# Altium schematic sheet PWR-1-cell Li-ion charger.SchDoc
size Letter
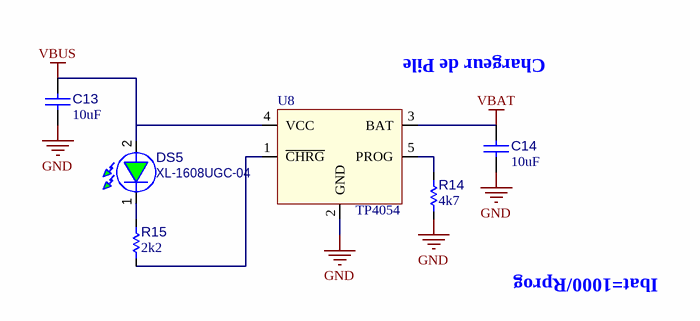
[diagram p0: PWR-1-cell Li-ion charger.SchDoc]

## Parts
C13  value 10uF  [C_2012[0805]]  (hidden comment: Cap 10uF 0805)
C14  value 10uF  [C_2012[0805]]  (hidden comment: Cap 10uF 0805)
DS5  XL-1608UGC-04  [D_LED_0603]
R14  value 4k7  [R_1005[0402]]  (hidden comment: Res 4k7 1% 0402)
R15  value 2k2  [R_1005[0402]]  (hidden comment: Res 2k2 1% 0402)
U8  TP4054  [U_SOT23-5N(MO-178)]

## Nets
GND: C13.1 C14.1 R14.1 U8.2(GND)
VBAT: C14.2 U8.3(BAT)
VBUS: C13.2 DS5.2(A) U8.4(VCC)
NetDS5_1: DS5.1(K) R15.2
NetR14_2: R14.2 U8.5(PROG)
NetR15_1: R15.1 U8.1(~{CHRG})

## Notes on the sheet
- (near U8) Chargeur de Pile
- Ibat=1000/Rprog

## Library data of the parts
C13 C14 = CAP004: Capacitor type 1; Manufacturer 1: Samsung; Manufacturer Part Number 1: CL21A106KAYNNNE; LibRef: CAP004; CEGEP: KCOND03SM; Tolerance: 10%; Rated Voltage: 25V; Dielectric: X5R; Supplier 1: LCSC; Supplier Part Number 1: C15850; Mounting Technology: SMT
DS5 = D_LED_GREEN_0603: LED Green Clear 40mcd 140deg; Manufacturer 1: XINGLIGHT; Value: Green; Supplier 1: LCSC; Supplier Part Number 1: C965804; Supplier 2: Digikey; Supplier Part Number 2: 732-4980-1-ND; Manufacturer 2: Wurth; Manufacturer Part Number 1: XL-1608UGC-04; Manufacturer Part Number 2: 150060VS75000; Mounting Technology: SMT
R14 = RES007: Resistor type 1; Manufacturer 1: Panasonic; Manufacturer Part Number 1: ERJ-2RKF4701X; LibRef: RES007; Puissance: 1/16W; Max Working Voltage: 50V; Tolerance: 1%; Supplier 1: LCSC; Supplier Part Number 1: C400631; Mounting Technology: SMT
R15 = RES008: Resistor type 1; Manufacturer 1: Yageo; Manufacturer Part Number 1: RC0402FR-072K2L; LibRef: RES008; Puissance: 1/16W; Max Working Voltage: 50V; Tolerance: 1%; Supplier 1: LCSC; Supplier Part Number 1: C114762; Supplier 2: Digi-Key; Supplier Part Number 2: 311-2.20KLRCT-ND; Mounting Technology: SMT
U8 = U_TP4054: Battery charger Li-ion Linear 1-cell; Manufacturer 1: HXY MOSFET; Manufacturer 2: Suntek; Manufacturer Part Number 2: SK4054S5-42; Manufacturer Part Number 1: TP4054; Supplier 1: LCSC; Supplier 2: Digikey; Supplier Part Number 1: C668215; Supplier Part Number 2: 4518-TP4054CT-ND; Mounting Technology: SMT